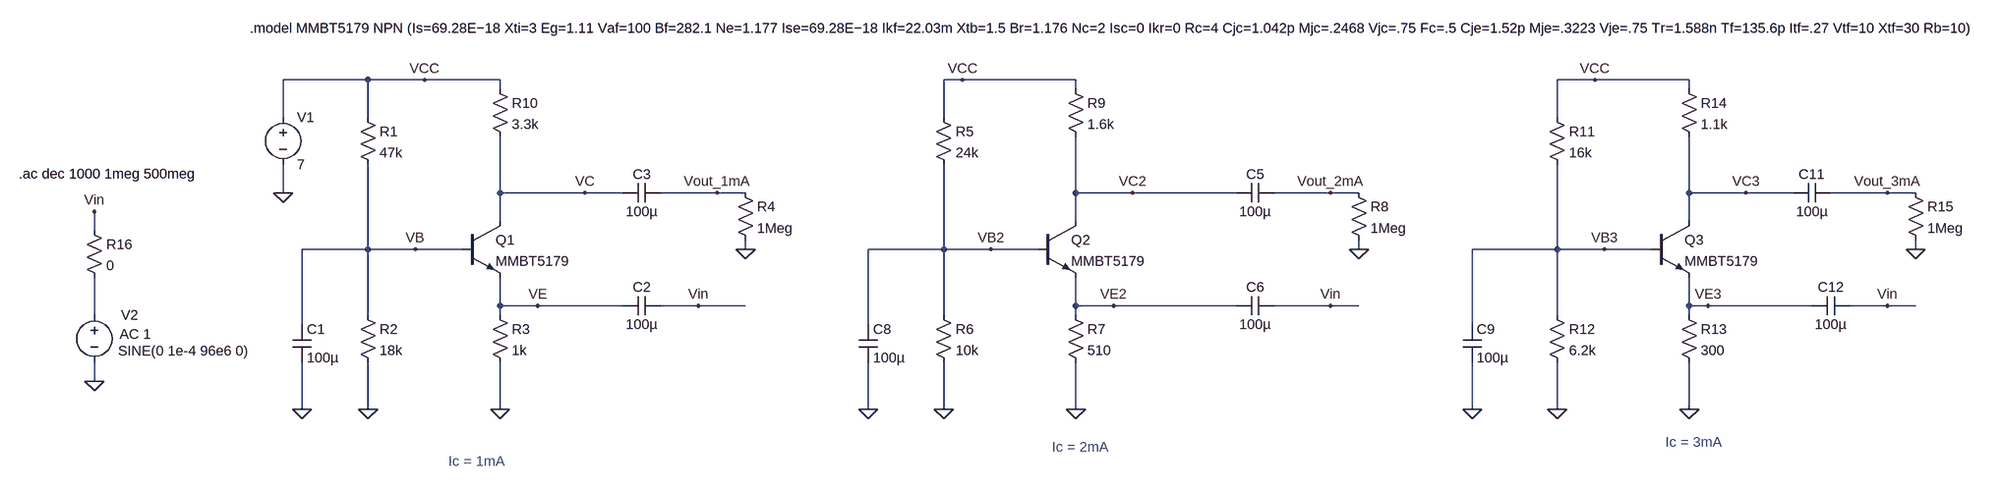
[diagram p0: schematic 2_Av_no_load.asc]
2_Av_no_load.asc, the LTspice schematic file:
Version 4
SHEET 1 1332 680
WIRE -1920 -1200 -2064 -1200
WIRE -1824 -1200 -1920 -1200
WIRE -1696 -1200 -1824 -1200
WIRE -912 -1200 -944 -1200
WIRE -720 -1200 -912 -1200
WIRE 160 -1200 96 -1200
WIRE 320 -1200 160 -1200
WIRE -1696 -1184 -1696 -1200
WIRE -720 -1184 -720 -1200
WIRE 320 -1184 320 -1200
WIRE -2064 -1136 -2064 -1200
WIRE -1920 -1136 -1920 -1200
WIRE -944 -1136 -944 -1200
WIRE 96 -1136 96 -1200
WIRE -2064 -1008 -2064 -1056
WIRE -1696 -1008 -1696 -1104
WIRE -1552 -1008 -1696 -1008
WIRE -1488 -1008 -1552 -1008
WIRE -1328 -1008 -1424 -1008
WIRE -1280 -1008 -1328 -1008
WIRE -720 -1008 -720 -1104
WIRE -624 -1008 -720 -1008
WIRE -448 -1008 -624 -1008
WIRE -288 -1008 -384 -1008
WIRE -240 -1008 -288 -1008
WIRE 320 -1008 320 -1104
WIRE 416 -1008 320 -1008
WIRE 496 -1008 416 -1008
WIRE 656 -1008 560 -1008
WIRE 704 -1008 656 -1008
WIRE -1696 -960 -1696 -1008
WIRE -720 -960 -720 -1008
WIRE 320 -960 320 -1008
WIRE -2384 -944 -2384 -976
WIRE -1920 -912 -1920 -1056
WIRE -1920 -912 -2032 -912
WIRE -1840 -912 -1920 -912
WIRE -1760 -912 -1840 -912
WIRE -1280 -912 -1280 -928
WIRE -944 -912 -944 -1056
WIRE -944 -912 -1072 -912
WIRE -864 -912 -944 -912
WIRE -784 -912 -864 -912
WIRE -240 -912 -240 -928
WIRE 96 -912 96 -1056
WIRE 96 -912 -48 -912
WIRE 176 -912 96 -912
WIRE 256 -912 176 -912
WIRE 704 -912 704 -928
WIRE -1696 -816 -1696 -864
WIRE -1632 -816 -1696 -816
WIRE -1488 -816 -1632 -816
WIRE -1360 -816 -1424 -816
WIRE -1280 -816 -1360 -816
WIRE -720 -816 -720 -864
WIRE -656 -816 -720 -816
WIRE -448 -816 -656 -816
WIRE -288 -816 -384 -816
WIRE -240 -816 -288 -816
WIRE 320 -816 320 -864
WIRE 352 -816 320 -816
WIRE 528 -816 352 -816
WIRE 656 -816 592 -816
WIRE 704 -816 656 -816
WIRE -2384 -800 -2384 -864
WIRE -1920 -800 -1920 -912
WIRE -1696 -800 -1696 -816
WIRE -944 -800 -944 -912
WIRE -720 -800 -720 -816
WIRE 96 -800 96 -912
WIRE 320 -800 320 -816
WIRE -2032 -784 -2032 -912
WIRE -1072 -784 -1072 -912
WIRE -48 -784 -48 -912
WIRE -2384 -688 -2384 -720
WIRE -2032 -640 -2032 -720
WIRE -1920 -640 -1920 -720
WIRE -1696 -640 -1696 -720
WIRE -1072 -640 -1072 -720
WIRE -944 -640 -944 -720
WIRE -720 -640 -720 -720
WIRE -48 -640 -48 -720
WIRE 96 -640 96 -720
WIRE 320 -640 320 -720
FLAG -2064 -1008 0
FLAG -1920 -640 0
FLAG -1696 -640 0
FLAG -1632 -816 VE
FLAG -1840 -912 VB
FLAG -1552 -1008 VC
FLAG -1824 -1200 VCC
FLAG -2384 -688 0
FLAG -1280 -912 0
FLAG -2032 -640 0
FLAG -944 -640 0
FLAG -720 -640 0
FLAG -656 -816 VE2
FLAG -864 -912 VB2
FLAG -624 -1008 VC2
FLAG -240 -912 0
FLAG -912 -1200 VCC
FLAG -1072 -640 0
FLAG -1328 -1008 Vout_1mA
FLAG -288 -1008 Vout_2mA
FLAG 96 -640 0
FLAG 320 -640 0
FLAG 352 -816 VE3
FLAG 176 -912 VB3
FLAG 416 -1008 VC3
FLAG -48 -640 0
FLAG 704 -912 0
FLAG 656 -1008 Vout_3mA
FLAG 160 -1200 VCC
FLAG -1360 -816 Vin
FLAG -288 -816 Vin
FLAG 656 -816 Vin
FLAG -2384 -976 Vin
SYMBOL res -1936 -1152 R0
SYMATTR InstName R1
SYMATTR Value 47k
SYMBOL res -1936 -816 R0
SYMATTR InstName R2
SYMATTR Value 18k
SYMBOL res -1712 -816 R0
SYMATTR InstName R3
SYMATTR Value 1k
SYMBOL voltage -2064 -1152 R0
WINDOW 123 0 0 Left 0
WINDOW 39 0 0 Left 0
SYMATTR InstName V1
SYMATTR Value 7
SYMBOL npn -1760 -960 R0
SYMATTR InstName Q1
SYMATTR Value MMBT5179
SYMBOL cap -2048 -784 R0
SYMATTR InstName C1
SYMATTR Value 100µ
SYMBOL cap -1424 -832 R90
WINDOW 0 0 32 VBottom 2
WINDOW 3 32 32 VTop 2
SYMATTR InstName C2
SYMATTR Value 100µ
SYMBOL cap -1424 -1024 R90
WINDOW 0 0 32 VBottom 2
WINDOW 3 32 32 VTop 2
SYMATTR InstName C3
SYMATTR Value 100µ
SYMBOL voltage -2384 -816 R0
WINDOW 0 45 16 Left 2
WINDOW 123 43 48 Left 2
WINDOW 39 0 0 Left 0
WINDOW 3 40 77 Left 2
SYMATTR InstName V2
SYMATTR Value2 AC 1
SYMATTR Value SINE(0 1e-4 96e6 0)
SYMBOL res -960 -1152 R0
SYMATTR InstName R5
SYMATTR Value 24k
SYMBOL res -960 -816 R0
SYMATTR InstName R6
SYMATTR Value 10k
SYMBOL res -736 -816 R0
SYMATTR InstName R7
SYMATTR Value 510
SYMBOL npn -784 -960 R0
SYMATTR InstName Q2
SYMATTR Value MMBT5179
SYMBOL cap -384 -1024 R90
WINDOW 0 0 32 VBottom 2
WINDOW 3 32 32 VTop 2
SYMATTR InstName C5
SYMATTR Value 100µ
SYMBOL cap -384 -832 R90
WINDOW 0 0 32 VBottom 2
WINDOW 3 32 32 VTop 2
SYMATTR InstName C6
SYMATTR Value 100µ
SYMBOL cap -1088 -784 R0
SYMATTR InstName C8
SYMATTR Value 100µ
SYMBOL res -736 -1200 R0
SYMATTR InstName R9
SYMATTR Value 1.6k
SYMBOL res -1712 -1200 R0
SYMATTR InstName R10
SYMATTR Value 3.3k
SYMBOL res 80 -1152 R0
SYMATTR InstName R11
SYMATTR Value 16k
SYMBOL res 80 -816 R0
SYMATTR InstName R12
SYMATTR Value 6.2k
SYMBOL res 304 -816 R0
SYMATTR InstName R13
SYMATTR Value 300
SYMBOL npn 256 -960 R0
SYMATTR InstName Q3
SYMATTR Value MMBT5179
SYMBOL cap -64 -784 R0
SYMATTR InstName C9
SYMATTR Value 100µ
SYMBOL res 304 -1200 R0
SYMATTR InstName R14
SYMATTR Value 1.1k
SYMBOL cap 560 -1024 R90
WINDOW 0 0 32 VBottom 2
WINDOW 3 32 32 VTop 2
SYMATTR InstName C11
SYMATTR Value 100µ
SYMBOL cap 592 -832 R90
WINDOW 0 0 32 VBottom 2
WINDOW 3 32 32 VTop 2
SYMATTR InstName C12
SYMATTR Value 100µ
SYMBOL res -2400 -960 R0
SYMATTR InstName R16
SYMATTR Value 0
SYMBOL res -1296 -1024 R0
SYMATTR InstName R4
SYMATTR Value 1Meg
SYMBOL res -256 -1024 R0
SYMATTR InstName R8
SYMATTR Value 1Meg
SYMBOL res 688 -1024 R0
SYMATTR InstName R15
SYMATTR Value 1Meg
TEXT -2120 -1288 Left 2 !.model MMBT5179 NPN (Is=69.28E−18 Xti=3 Eg=1.11 Vaf=100 Bf=282.1 Ne=1.177 Ise=69.28E−18 Ikf=22.03m Xtb=1.5 Br=1.176 Nc=2 Isc=0 Ikr=0 Rc=4 Cjc=1.042p Mjc=.2468 Vjc=.75 Fc=.5 Cje=1.52p Mje=.3223 Vje=.75 Tr=1.588n Tf=135.6p Itf=.27 Vtf=10 Xtf=30 Rb=10)
TEXT -2512 -1040 Left 2 !.ac dec 1000 1meg 500meg
TEXT -1784 -552 Left 2 ;Ic = 1mA
TEXT -760 -576 Left 2 ;Ic = 2mA
TEXT 280 -584 Left 2 ;Ic = 3mA

The netlist it stands for:
* 2_Av_no_load.asc
R1 VCC VB 47k
R2 VB 0 18k
R3 VE 0 1k
V1 VCC 0 7
Q1 VC VB VE 0 MMBT5179
C1 VB 0 100µ
C2 Vin VE 100µ
C3 Vout_1mA VC 100µ
V2 N001 0 SINE(0 1e-4 96e6 0) AC 1
R5 VCC VB2 24k
R6 VB2 0 10k
R7 VE2 0 510
Q2 VC2 VB2 VE2 0 MMBT5179
C5 Vout_2mA VC2 100µ
C6 Vin VE2 100µ
C8 VB2 0 100µ
R9 VCC VC2 1.6k
R10 VCC VC 3.3k
R11 VCC VB3 16k
R12 VB3 0 6.2k
R13 VE3 0 300
Q3 VC3 VB3 VE3 0 MMBT5179
C9 VB3 0 100µ
R14 VCC VC3 1.1k
C11 Vout_3mA VC3 100µ
C12 Vin VE3 100µ
R16 Vin N001 0
R4 Vout_1mA 0 1Meg
R8 Vout_2mA 0 1Meg
R15 Vout_3mA 0 1Meg
.model NPN NPN
.model PNP PNP
.lib standard.bjt
.model MMBT5179 NPN (Is=69.28E−18 Xti=3 Eg=1.11 Vaf=100 Bf=282.1 Ne=1.177 Ise=69.28E−18 Ikf=22.03m Xtb=1.5 Br=1.176 Nc=2 Isc=0 Ikr=0 Rc=4 Cjc=1.042p Mjc=.2468 Vjc=.75 Fc=.5 Cje=1.52p Mje=.3223 Vje=.75 Tr=1.588n Tf=135.6p Itf=.27 Vtf=10 Xtf=30 Rb=10)
.ac dec 1000 1meg 500meg
* Ic = 1mA
* Ic = 2mA
* Ic = 3mA
.backanno
.end